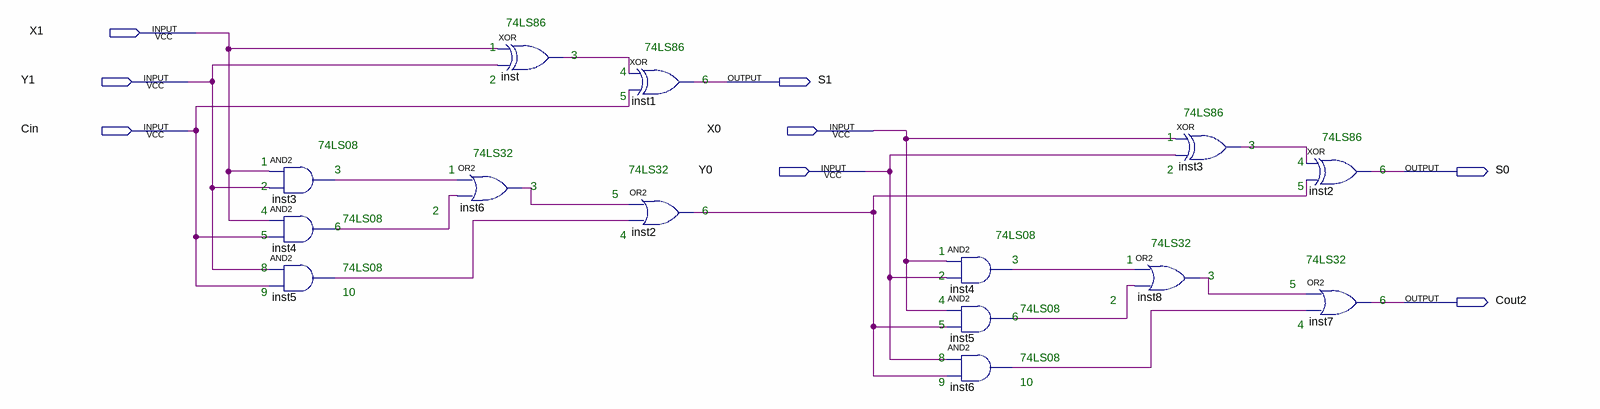
[diagram p0: schematic sheet]
// Quartus schematic Lab6Q1.bdf as structural Verilog: 14 symbols, 8 pins
module Lab6Q1 (
  input  X1,
  input  Y1,
  input  Cin,
  input  X0,
  input  Y0,
  output S1,
  output S0,
  output Cout2
);

  wire inst2_out, inst3_out, inst3_out_2, inst4_out, inst4_out_2, inst5_out, inst5_out_2, inst6_out,
       inst6_out_2, inst8_out, inst_out;

  and inst3 (inst3_out_2, X1, Y1);
  and inst4 (inst4_out, X1, Cin);
  and inst5 (inst5_out, Y1, Cin);
  xor inst (inst_out, X1, Y1);
  or inst6 (inst6_out, inst3_out_2, inst4_out);
  xor inst1 (S1, inst_out, Cin);
  or inst2 (inst2_out, inst6_out, inst5_out);
  and inst4_dup2 (inst4_out_2, X0, Y0);
  and inst5_dup2 (inst5_out_2, X0, inst2_out);
  and inst6_dup2 (inst6_out_2, Y0, inst2_out);
  or inst8 (inst8_out, inst4_out_2, inst5_out_2);
  xor inst3_dup2 (inst3_out, X0, Y0);
  xor inst2_dup2 (S0, inst3_out, inst2_out);
  or inst7 (Cout2, inst8_out, inst6_out_2);

  // Notes on the sheet:
  //   74LS86
  //   1
  //   74LS86
  //   3
  //   4
  //   2
  //   6
  //   5
  //   74LS86
  //   1
  //   74LS86
  //   74LS08
  //   3
  //   74LS32
  //   1
  //   4
  //   3
  //   1
  //   74LS32
  //   2
  //   6
  //   2
  //   3
  //   5
  //   5
  //   4
  //   2
  //   6
  //   74LS08
  //   6
  //   5
  //   4
  //   74LS08
  //   74LS32
  //   1
  //   3
  //   1
  //   74LS32
  //   8
  //   74LS08
  //   2
  //   3
  //   5
  //   9
  //   10
  //   4
  //   2
  //   6
  //   74LS08
  //   6
  //   5
  //   4
  //   8
  //   74LS08
  //   9
  //   10
endmodule
